# EAGLE design ISP-Adapter (EAGLE 7.1.0)
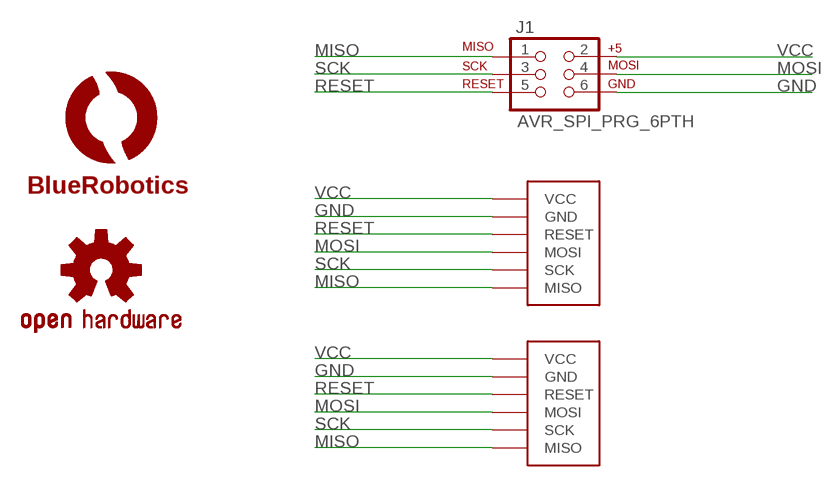
[diagram p0: schematic, sheet 1]

## Parts
J1  AVR_SPI_PRG_6PTH  [2X3]
LOGO1  OSHW-LOGOS  [OSHW-LOGO-S]
U$1  AVR-ISPTINY-SMD  [AVR-ISP-TINY]
U$2  AVR-ISPTINY-SMD-POGO  [AVR-ISP-TINY-POGO]
U$3  LOGOBR-LOGO-S  [BR-LOGO-SMALL]

## Nets
GND: J1.6 U$1.GND U$2.GND
MISO: J1.1 U$1.MISO U$2.MISO
MOSI: J1.4 U$1.MOSI U$2.MOSI
RESET: J1.5 U$1.RESET U$2.RESET
SCK: J1.3 U$1.SCK U$2.SCK
VCC: J1.2 U$1.VCC U$2.VCC

## Library data of the parts
J1 = SparkFun-Connectors:AVR_SPI_PRG_6: AVR ISP 6 Pin This is the reduced ISP connector for AVR programming. Common on Arduino. This footprint will take up less PCB space and can be used with a 10-pin to 6-pin adapter such as SKU: BOB-08508 **Special note about "TEST_POINT" package. The stop mask is on the top side, so if you want your programming test points to be on the bottom of your board, make sure to place this package on the bottom side of the board. This also ensure that the orientation to program from the bottom side will be correct.
LOGO1 = SparkFun-Aesthetics:OSHW-LOGO: Open Source Hardware Logo This logo indicates the piece of hardware it is found on incorporates a OSHW license and/or adheres to the definition of open source hardware found here: http://freedomdefined.org/OSHW
U$1 U$2 = BR-Eagle-Library:AVR-ISP
U$3 = BR-Eagle-Library:LOGO

## Board
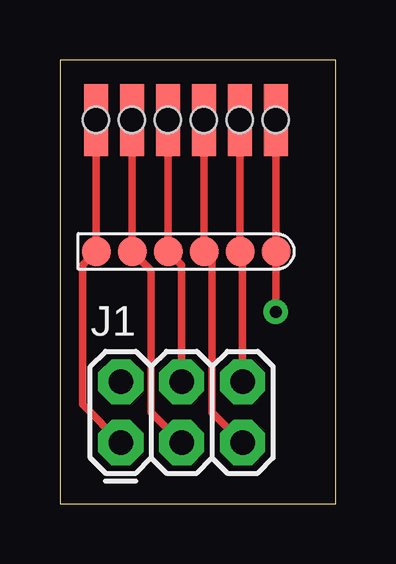
[diagram p1: board, top side]
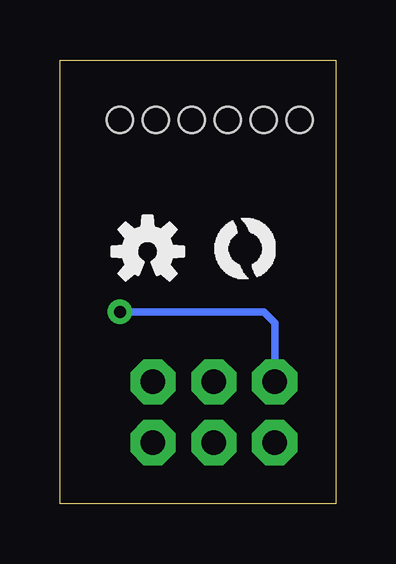
[diagram p2: board, bottom side, seen from below]

Size 11.5 x 18.5 mm. Coordinates in mm from the lower left corner, seen from the top.
Outline: 0,0 11.5,0 11.5,18.5 0,18.5 0,0
Copper layers (1*16): Top 0.0356mm / dielectric 1.5011mm / Bottom 0.0356mm
Design rules "OSH-Park": minimum track width 6mil, minimum drill 13mil, track to track 6mil, track to pad 6mil, pad to pad 6mil, via to via 6mil, smd to smd 6mil, copper to edge 15mil, drill to drill 6mil, minimum pad ring 7mil, minimum via ring 7mil, stop-mask expansion 3mil, vias tented up to drill 0mil, thermal gap 10mil

### Footprints (pad centres in the part's own frame; a part is rotated, then mirrored left to right if it is on the bottom)
2X3 = drill 1.016 pad 1.88 octagon: 1 0,0; 2 0,2.54; 3 2.54,0; 4 2.54,2.54; 5 5.08,0; 6 5.08,2.54
AVR-ISP-TINY = smd 1.2 x 1.2: GND 1.5,0; MISO 7.5,0; MOSI 4.5,0; RESET 3,0; SCK 6,0; VCC 0,0
AVR-ISP-TINY-POGO = smd 1 x 3: GND 1.5,0; MISO 7.5,0; MOSI 4.5,0; RESET 3,0; SCK 6,0; VCC 0,0 | hole 1.1: 0,0; 1.5,0; 3,0; 4.5,0; 6,0; 7.5,0

### Placement (x,y rotation side)
J1  2.54,2.54 0 top
LOGO1  7.84,10.51 0 bottom
U$1  9.02,10.51 180 top
U$2  9,16 180 top
U$3  5.03,9.38 0 bottom

### Tracks (layer width: path | path; a pad name or v marks a point on that pad's centre or on a via)
GND
  Top 0.305: J1.6 7.62,10.41 U$1.GND 7.52,15.98 U$2.GND
MISO
  Top 0.305: J1.1 0.95,4.13 0.95,9.95 U$1.MISO 1.52,15.98 U$2.MISO
MOSI
  Top 0.305: J1.4 5.08,9.95 U$1.MOSI 4.52,15.98 U$2.MOSI
RESET
  Top 0.305: J1.5 6.35,3.81 6.35,10.18 U$1.RESET 6.02,15.98 U$2.RESET
SCK
  Top 0.305: J1.3 3.81,3.81 3.81,9.72 U$1.SCK 3.02,15.98 U$2.SCK
VCC  (via drill 0.5 pad 1.02)
  Top 0.305: v9,8 9,10.49 U$1.VCC 9.02,15.98 U$2.VCC
  Bottom 0.305: J1.2 2.54,7.54 3,8 v9,8

### Text on the board
Reference: ISP-ADAPTER-POGO-X1
bDocu: R.J. 10/14